# Altium project JTAG Breakout Breadboard.PrjPcb
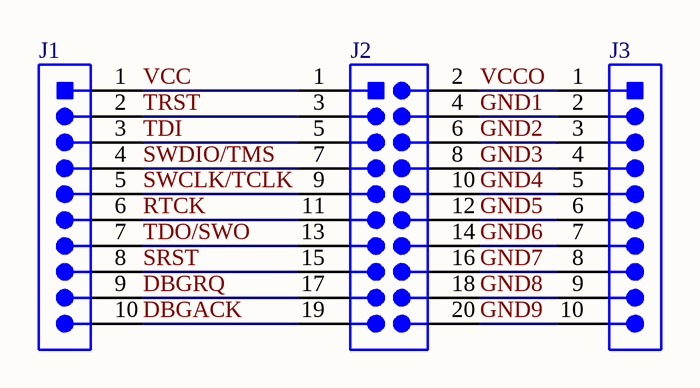
[diagram p0: Top Sheet.SchDoc]

1 sheet, 3 parts. Net scope: global (net labels, ports and power ports of the same name join across sheets).
Board file: JTAG Breakout Breadboard.PcbDoc

## Sheet Top Sheet.SchDoc
size Letter; Address4: USA

### Parts
J1  10 contacts Male header  [10129380-910001ALF]  (value not drawn)
J2  Arm® JTAG 20 connector  [3020-20-0300-00 PLUGMID]  (value not drawn)
J3  10 contacts Male header  [10129380-910001ALF]  (value not drawn)

### Nets
~{SRST}: J1.8 J2.15(~{SRST})
~{TRST}: J1.2 J2.3(~{TRST})
DBGACK: J1.10 J2.19(DBGACK_or_VCC_IN)
DBGRQ: J1.9 J2.17(DBGRQ)
GND1: J2.4 J3.2
GND2: J2.6 J3.3
GND3: J2.8 J3.4
GND4: J2.10 J3.5
GND5: J2.12 J3.6
GND6: J2.14 J3.7
GND7: J2.16 J3.8
GND8: J2.18 J3.9
GND9: J2.20 J3.10
RTCK: J1.6 J2.11(RTCK)
SWCLK/TCLK: J1.5 J2.9(TCK/SWCLK)
SWDIO/TMS: J1.4 J2.7(TMS/SWDIO)
TDI: J1.3 J2.5(TDI)
TDO/SWO: J1.7 J2.13(TDO/SWO)
VCC: J1.1 J2.1(VCC_Tgt)
VCCO: J2.2(VCC_(Opt)) J3.1

### Notes on the sheet
- Title:
- Desc:
- Size:
- Date:
- File:
- Repo:
- Letter
- Auth:
- Time:
- Sheet
- Proj:
- of

### Library data of the parts
J1 J3 = 10129380-910001ALF: Connector Male Header 1X10 vertical 10contacts 0.100in pitch Gold finish SMD; Manufacturer: FCI; Description in Visual: Con Hdr Male 10contacts vertical 1X10; Number of Contacts: 10; P/N: 10129380-910001ALF; Manufacturer P/N: 10129380-910001ALF; PCB Package: 10129380-910001ALF; Orientation: vertical; Number of Rows: 1; Pitch: 0.100in; Contact Finish: Gold; Gender: Male; ComponentLink1Description: Manufacturer Website; ComponentLink1URL: http://www.fci.com; ComponentLink2Description: Component Datasheet; ComponentLink2URL: https://cdn.amphenol-icc.com/media/wysiwyg/files/drawing/10129380.pdf; ComponentLink3Description: Octopart Link; ComponentLink3URL: https://octopart.com/10129380-910001alf-amphenol+icc+%2F+fci-87314063?r=sp; Supplier 1: Digi-Key; Supplier Part Number 1: 609-10129380-910001ALFCT-ND
J2 = ARM Standard Debug SMD: 20 Pin Shrouded Header, 0.100" SMD; Manufacturer: CNC Tech; Manufacturer P/N: Various; Number of Contacts: 20; Gender: Male; P/N: ARM Standard Debug SMD; Description in Visual: 20 Pin Shrouded Header, 0.100" SMD; Orientation: Vertical; Number of Rows: 2; Pitch: 0.100"; Contact Finish: Gold; ComponentLink1Description: Pinout Reference; ComponentLink1URL: http://infocenter.arm.com/help/index.jsp?topic=/com.arm.doc.100893_0100_02_en/ris1452189032721.html; ComponentLink2Description: Datasheet for Connector; ComponentLink2URL: http://www.cnctech.us/pdfs/3020-XX-0300-00-TR.pdf; Supplier 1: Digi-Key; Supplier Part Number 1: 1175-1623-ND